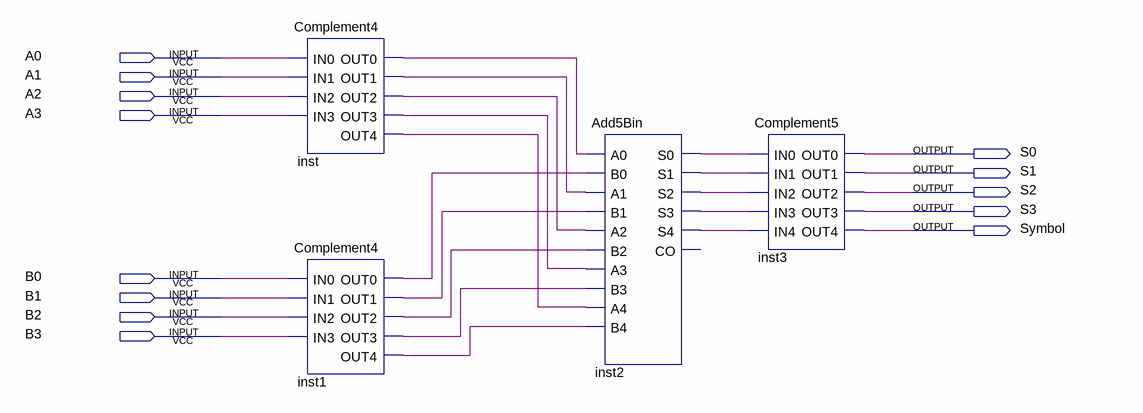
[diagram p0: schematic sheet]
// Quartus schematic AddAndMinus.bdf as structural Verilog: 4 symbols, 13 pins
module AddAndMinus (
  input  A0,
  input  A1,
  input  A2,
  input  A3,
  input  B0,
  input  B1,
  input  B2,
  input  B3,
  output S0,
  output S1,
  output S2,
  output S3,
  output Symbol
);

  wire inst1_out0, inst1_out1, inst1_out2, inst1_out3, inst1_out4, inst2_s0, inst2_s1, inst2_s2, inst2_s3,
       inst2_s4, inst_out0, inst_out1, inst_out2, inst_out3, inst_out4;

  Complement4 inst (
    .IN0(A0), .IN1(A1), .IN2(A2), .IN3(A3), .OUT0(inst_out0), .OUT1(inst_out1), .OUT2(inst_out2),
    .OUT3(inst_out3), .OUT4(inst_out4));
  Complement4 inst1 (
    .IN0(B0), .IN1(B1), .IN2(B2), .IN3(B3), .OUT0(inst1_out0), .OUT1(inst1_out1), .OUT2(inst1_out2),
    .OUT3(inst1_out3), .OUT4(inst1_out4));
  Add5Bin inst2 (
    .A0(inst_out0), .B0(inst1_out0), .A1(inst_out1), .B1(inst1_out1), .A2(inst_out2), .B2(inst1_out2),
    .A3(inst_out3), .B3(inst1_out3), .A4(inst_out4), .B4(inst1_out4), .S0(inst2_s0), .S1(inst2_s1),
    .S2(inst2_s2), .S3(inst2_s3), .S4(inst2_s4));  // open: CO
  Complement5 inst3 (
    .IN0(inst2_s0), .IN1(inst2_s1), .IN2(inst2_s2), .IN3(inst2_s3), .IN4(inst2_s4), .OUT0(S0), .OUT1(S1),
    .OUT2(S2), .OUT3(S3), .OUT4(Symbol));
endmodule
